# EAGLE design circuito_rele (EAGLE 8.1.1)
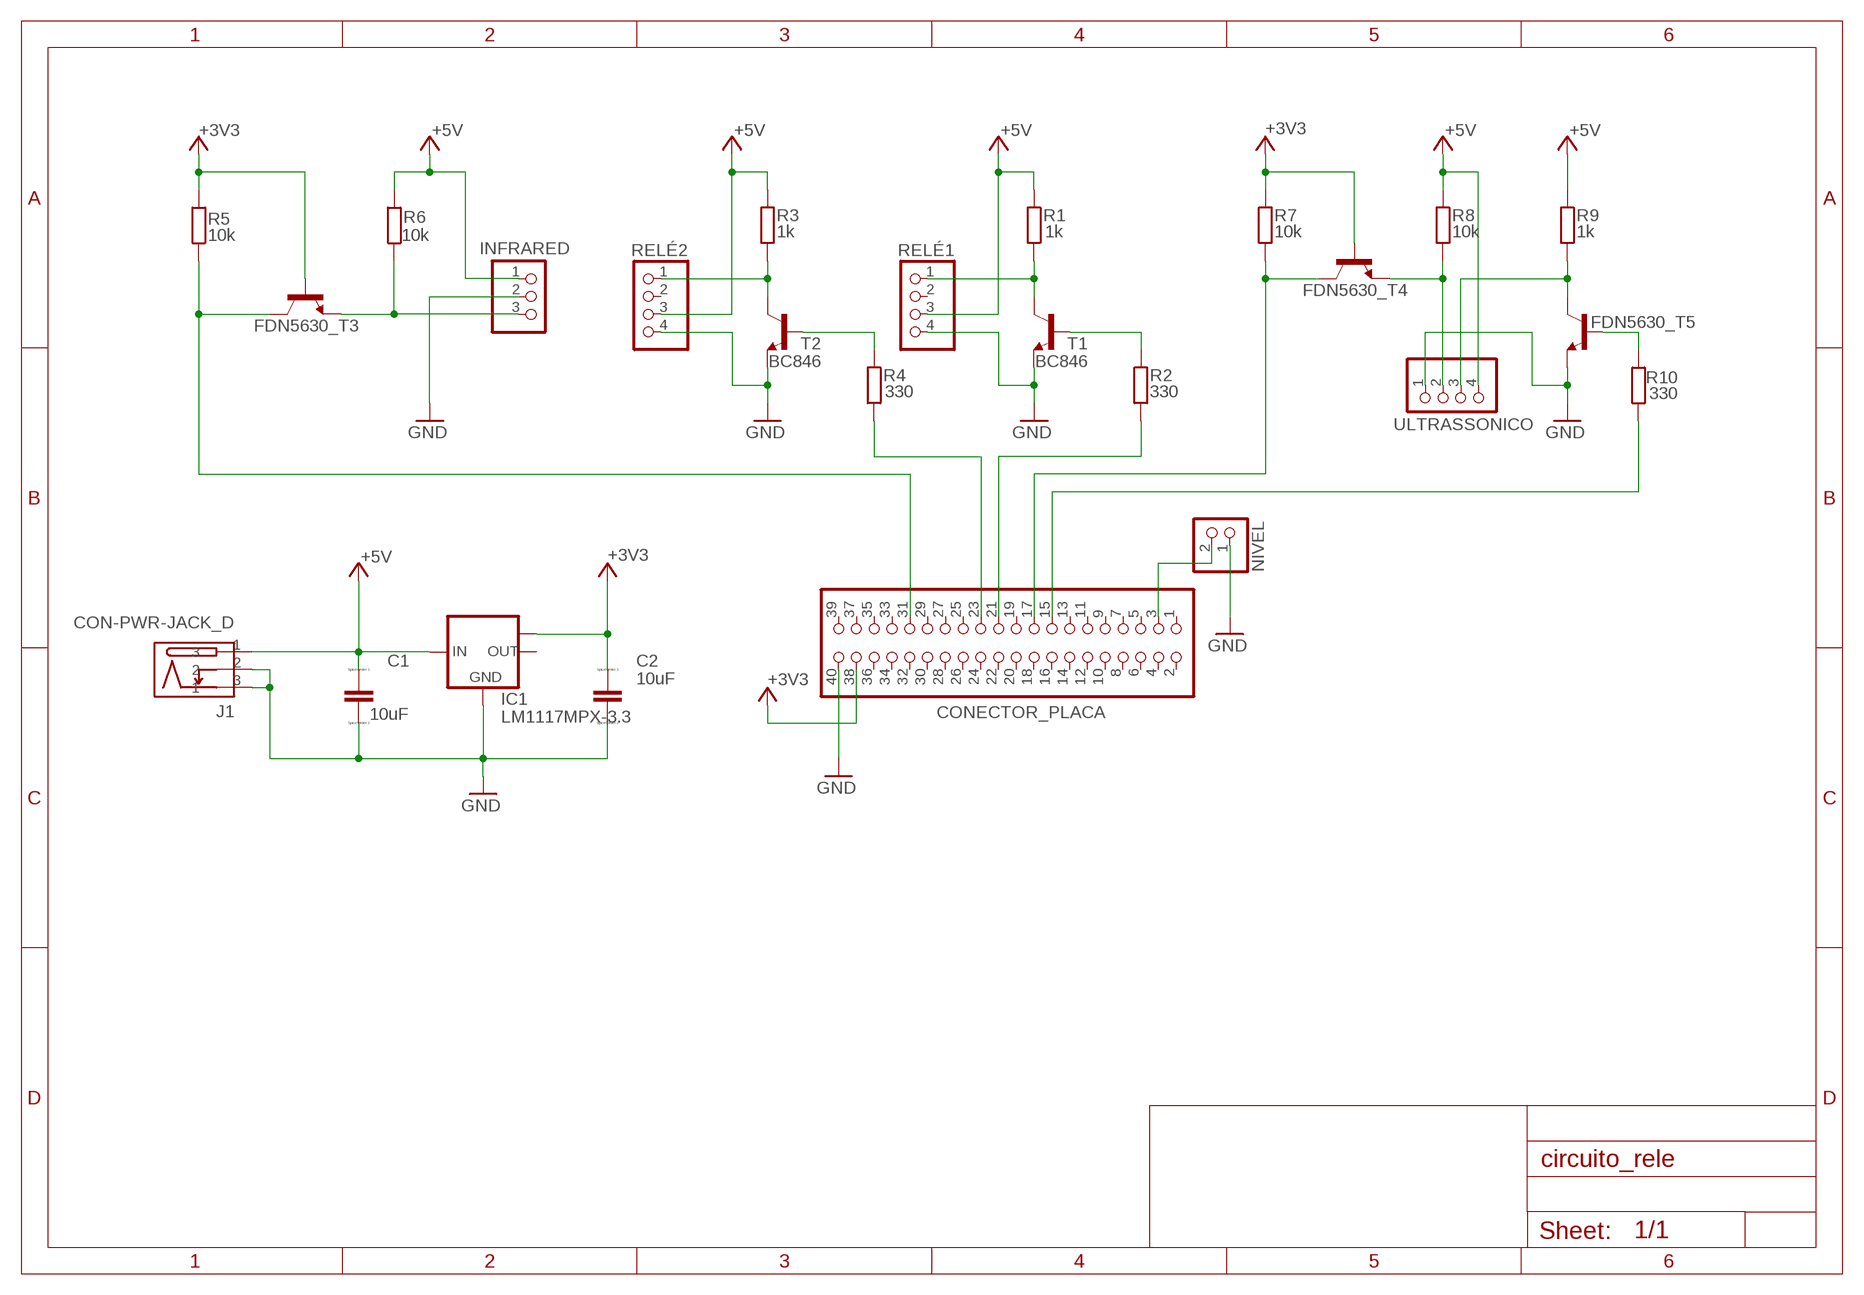
[diagram p0: schematic, sheet 1]

## Parts
C1  10uF  CC4532  [C4532]
C2  10uF  CC4532  [C4532]
CONECTOR_PLACA  PINHD-2X20  [2X20]
FDN5630_T3  BC846  [SOT23]
FDN5630_T4  BC846  [SOT23]
FDN5630_T5  BC846  [SOT23]
IC1  LM1117MPX-3.3  [SOT223]
INFRARED  PINHD-1X3  [1X03]
J1  CON-PWR-JACK_D  [TDC-002-3]
NIVEL  PINHD-1X2  [1X02]
R1  1k  R-EU_0207/10  [0207/10]
R2  330  R-EU_0207/10  [0207/10]
R3  1k  R-EU_0207/10  [0207/10]
R4  330  R-EU_0207/10  [0207/10]
R5  10k  R-EU_0207/10  [0207/10]
R6  10k  R-EU_0207/10  [0207/10]
R7  10k  R-EU_0207/10  [0207/10]
R8  10k  R-EU_0207/10  [0207/10]
R9  1k  R-EU_0207/10  [0207/10]
R10  330  R-EU_0207/10  [0207/10]
RELÉ1  PINHD-1X4  [1X04]
RELÉ2  PINHD-1X4  [1X04]
T1  BC846  [SOT23]
T2  BC846  [SOT23]
ULTRASSONICO  PINHD-1X4  [1X04]

## Nets
+3V3: C2.1 CONECTOR_PLACA.38 FDN5630_T3.1(B) FDN5630_T4.1(B) IC1.TAB(OUT1) R5.2 R7.1
+5V: C1.1 IC1.3(IN) INFRARED.1 J1.1 R1.1 R3.1 R6.2 R8.1 R9.1 RELÉ1.3 RELÉ2.3 ULTRASSONICO.4
GND: C1.2 C2.2 CONECTOR_PLACA.40 FDN5630_T5.2(E) IC1.1(GND) INFRARED.2 J1.2 J1.3 NIVEL.1 RELÉ1.4 RELÉ2.4 T1.2(E) T2.2(E) ULTRASSONICO.1
N$1: R1.2 RELÉ1.1 T1.3(C)
N$2: R4.1 T2.1(B)
N$3: CONECTOR_PLACA.23 R4.2
N$4: R3.2 RELÉ2.1 T2.3(C)
N$5: R2.1 T1.1(B)
N$6: CONECTOR_PLACA.21 R2.2
N$7: FDN5630_T3.2(E) INFRARED.3 R6.1
N$8: CONECTOR_PLACA.17 FDN5630_T4.3(C) R7.2
N$9: CONECTOR_PLACA.31 FDN5630_T3.3(C) R5.1
N$10: FDN5630_T5.3(C) R9.2 ULTRASSONICO.3
N$11: FDN5630_T4.2(E) R8.2 ULTRASSONICO.2
N$12: FDN5630_T5.1(B) R10.2
N$13: CONECTOR_PLACA.15 R10.1
N$14: CONECTOR_PLACA.3 NIVEL.2
Unconnected: CONECTOR_PLACA.1 CONECTOR_PLACA.2 CONECTOR_PLACA.4 CONECTOR_PLACA.5 CONECTOR_PLACA.6 CONECTOR_PLACA.7 CONECTOR_PLACA.8 CONECTOR_PLACA.9 CONECTOR_PLACA.10 CONECTOR_PLACA.11 CONECTOR_PLACA.12 CONECTOR_PLACA.13 CONECTOR_PLACA.14 CONECTOR_PLACA.16 CONECTOR_PLACA.18 CONECTOR_PLACA.19 CONECTOR_PLACA.20 CONECTOR_PLACA.22 CONECTOR_PLACA.24 CONECTOR_PLACA.25 CONECTOR_PLACA.26 CONECTOR_PLACA.27 CONECTOR_PLACA.28 CONECTOR_PLACA.29 CONECTOR_PLACA.30 CONECTOR_PLACA.32 CONECTOR_PLACA.33 CONECTOR_PLACA.34 CONECTOR_PLACA.35 CONECTOR_PLACA.36 CONECTOR_PLACA.37 CONECTOR_PLACA.39 IC1.2(OUT) RELÉ1.2 RELÉ2.2

## Library data of the parts
C1 C2 = eagle-ltspice:C: CAPACITOR, European symbol; SPICEMODEL: NONE; SPICEPREFIX: C
CONECTOR_PLACA = pinhead:PINHD-2X20: PIN HEADER
FDN5630_T3-FDN5630_T5 T1 T2 = transistor:BC846: NPN TRANSISTOR
IC1 = lm1117:LM1117MPX-*
INFRARED = pinhead:PINHD-1X3: PIN HEADER
J1 = m-pad-2.1:CON-PWR-JACK: Various Power Jack with diameter of 2mm, 2.1mm and 2.5mm
NIVEL = pinhead:PINHD-1X2: PIN HEADER
R1-R10 = rcl:R-EU_: RESISTOR, European symbol
RELÉ1 RELÉ2 ULTRASSONICO = pinhead:PINHD-1X4: PIN HEADER

## Board
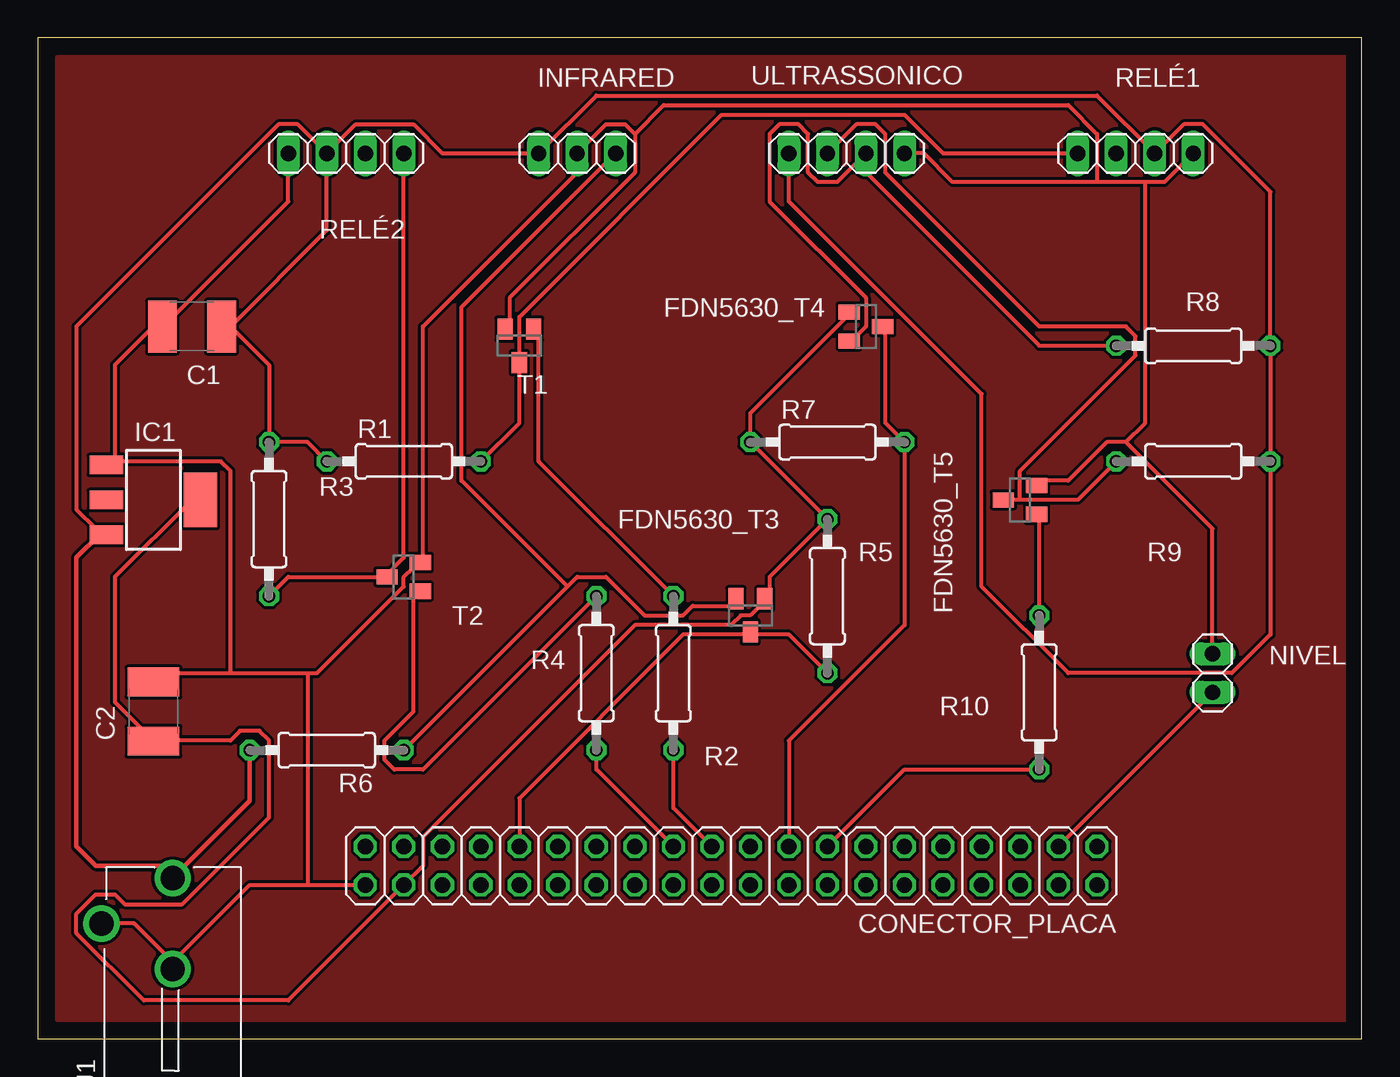
[diagram p1: board, top side]

Size 87.3 x 66.03 mm. Coordinates in mm from the lower left corner, seen from the top.
Outline: 0,0 87.3,0 87.3,66.03 0,66.03 0,0
Copper layers (1*16): Top 0.035mm / dielectric 1.5mm / Bottom 0.035mm
Design rules "default": minimum track width 10mil, minimum drill 24mil, track to track 8mil, track to pad 8mil, pad to pad 8mil, via to via 8mil, smd to smd 8mil, copper to edge 40mil, drill to drill 8mil, minimum pad ring 10mil, minimum via ring 8mil, stop-mask expansion 4mil, vias tented up to drill 0mil, thermal gap 10mil

### Footprints (pad centres in the part's own frame; a part is rotated, then mirrored left to right if it is on the bottom)
C4532 = smd 1.9 x 3.4: 1 -1.95,0; 2 1.95,0
2X20 = drill 1.016 octagon: 1 -24.13,-1.27; 2 -24.13,1.27; 3 -21.59,-1.27; 4 -21.59,1.27; 5 -19.05,-1.27; 6 -19.05,1.27; 7 -16.51,-1.27; 8 -16.51,1.27; 9 -13.97,-1.27; 10 -13.97,1.27; 11 -11.43,-1.27; 12 -11.43,1.27; 13 -8.89,-1.27; 14 -8.89,1.27; 15 -6.35,-1.27; 16 -6.35,1.27; 17 -3.81,-1.27; 18 -3.81,1.27; 19 -1.27,-1.27; 20 -1.27,1.27; 21 1.27,-1.27; 22 1.27,1.27; 23 3.81,-1.27; 24 3.81,1.27; 25 6.35,-1.27; 26 6.35,1.27; 27 8.89,-1.27; 28 8.89,1.27; 29 11.43,-1.27; 30 11.43,1.27; 31 13.97,-1.27; 32 13.97,1.27; 33 16.51,-1.27; 34 16.51,1.27; 35 19.05,-1.27; 36 19.05,1.27; 37 21.59,-1.27; 38 21.59,1.27; 39 24.13,-1.27; 40 24.13,1.27
SOT23 = smd 1 x 1.4: 1 -0.95,-1.1; 2 0.95,-1.1; 3 0,1.1
SOT223 = smd 1.219 x 2.235: 1 -2.311,-3.099; 2 0,-3.099; 3 2.311,-3.099 | smd 3.6 x 2.2: TAB 0,3.099
1X03 = drill 1.016 long: 1 -2.54,0; 2 0,0; 3 2.54,0
TDC-002-3 = drill 1.6: 1 3,0; 2 -3,0; 3 0,4.7
1X02 = drill 1.016 long: 1 -1.27,0; 2 1.27,0
0207/10 = drill 0.813 octagon: 1 -5.08,0; 2 5.08,0
1X04 = drill 1.016 long: 1 -3.81,0; 2 -1.27,0; 3 1.27,0; 4 3.81,0

### Placement (x,y rotation side)
C1  10.16,46.99 180 top
C2  7.62,21.59 90 top
CONECTOR_PLACA  45.72,11.43 180 top
FDN5630_T3  46.99,27.94 180 top
FDN5630_T4  54.61,46.99 270 top
FDN5630_T5  64.77,35.56 90 top
IC1  7.62,35.56 270 top
INFRARED  35.56,58.42 0 top
J1  8.89,7.62 90 top
NIVEL  77.47,24.13 270 top
R1  24.13,38.1 0 top
R2  41.91,24.13 270 top
R3  15.24,34.29 270 top
R4  36.83,24.13 270 top
R5  52.07,29.21 90 top
R6  19.05,19.05 180 top
R7  52.07,39.37 0 top
R8  76.2,45.72 180 top
R9  76.2,38.1 180 top
R10  66.04,22.86 90 top
RELÉ1  72.39,58.42 0 top
RELÉ2  20.32,58.42 180 top
T1  31.75,45.72 180 top
T2  24.13,30.48 90 top
ULTRASSONICO  53.34,58.42 180 top

### Tracks (layer width: path | path; a pad name or v marks a point on that pad's centre or on a via)
+3V3
  Top 0.254: 7.62,19.68 5.08,22.23 5.08,30.48 10.16,35.56 IC1.TAB | FDN5630_T4.1 53.34,47.62 46.99,41.27 R7.1 R5.2 48.26,30.48 48.26,29.21 FDN5630_T3.1 47.62,28.57 46.99,27.94 46.35,27.94 45.72,27.3 39.37,27.3 25.4,13.34 25.4,11.43 CONECTOR_PLACA.38 16.51,2.54 6.99,2.54 2.54,6.99 2.54,8.26 3.81,9.53 5.08,9.53 5.71,8.89 9.53,8.89 15.24,14.61 15.24,19.68 14.61,20.32 13.34,20.32 12.7,19.68 7.62,19.68 | 7.62,19.68 C2.1
+5V
  Top 0.254: ULTRASSONICO.4 49.53,55.24 62.23,42.55 62.23,29.84 67.94,24.13 78.74,24.13 81.28,26.67 R9.1 R8.1 81.28,55.88 76.83,60.33 75.56,60.33 RELÉ1.3 69.85,62.23 36.83,62.23 INFRARED.1 26.67,58.42 24.77,60.33 20.95,60.33 RELÉ2.3 | R1.1 17.78,39.37 R3.1 15.24,44.45 12.7,46.99 | RELÉ2.3 19.05,53.34 12.7,46.99 | 12.7,46.99 C1.1 | RELÉ2.3 17.14,60.33 15.88,60.33 2.54,46.99 2.54,34.92 3.81,33.66 4.45,33.66 IC1.3
  Top 0.305: IC1.3 4.04,33.25 2.54,31.75 2.54,12.7 3.81,11.43 8.08,11.43 J1.1 13.97,15.7 R6.2
GND
  Top 0.254: ULTRASSONICO.1 58.42,58.42 60.33,56.52 69.85,56.52 | 73.03,56.52 74.3,56.52 RELÉ1.4 | 73.03,56.52 69.85,56.52 | 71.75,39.37 70.48,39.37 67.94,36.83 66.04,36.83 FDN5630_T5.2 | 71.75,39.37 77.47,33.66 NIVEL.1 | 73.03,56.52 73.03,40.64 71.75,39.37 | 5.08,38.1 5.08,44.45 7.62,46.99 C1.2 8.26,46.99 16.51,55.24 RELÉ2.4 | 17.78,10.16 13.97,10.16 8.89,5.08 | 17.78,10.16 CONECTOR_PLACA.40 | J1.3 6.35,7.62 8.89,5.08 | 8.89,5.08 J1.2 | 39.37,59.69 39.37,57.15 31.11,48.9 31.11,46.99 T1.2 | 39.37,59.69 38.73,60.33 37.47,60.33 INFRARED.2 35.56,57.15 25.4,46.99 25.4,31.75 T2.2 24.77,31.11 24.13,30.48 24.13,29.84 18.41,24.13 17.78,24.13 | 12.7,24.13 7.62,24.13 C2.2 | 12.7,24.13 17.78,24.13 | 17.78,24.13 17.78,10.16 | 5.08,38.1 12.06,38.1 12.7,37.47 12.7,24.13 | 5.08,38.1 IC1.1 | 69.85,56.52 69.85,59.69 67.94,61.59 41.27,61.59 39.37,59.69
N$1
  Top 0.254: R1.2 31.75,40.64 T1.3 31.75,47.62 45.09,60.96 57.15,60.96 59.69,58.42 RELÉ1.1
N$2
  Top 0.254: R4.1 25.4,17.78 23.5,17.78 22.86,18.41 22.86,19.68 24.77,21.59 24.77,29.21 T2.1
N$3
  Top 0.254: R4.2 36.83,17.78 CONECTOR_PLACA.23
N$4
  Top 0.254: 22.86,30.48 16.51,30.48 R3.2 | RELÉ2.1 24.13,31.75 22.86,30.48 | 22.86,30.48 T2.3
N$5
  Top 0.254: R2.1 33.02,38.1 33.02,46.35 T1.1
N$6
  Top 0.254: R2.2 41.91,15.24 CONECTOR_PLACA.21
N$7
  Top 0.254: R6.1 34.92,29.84 | 34.92,29.84 35.56,30.48 37.47,30.48 40.01,27.94 42.55,27.94 43.18,28.57 45.72,28.57 FDN5630_T3.2 | INFRARED.3 27.94,48.26 27.94,36.83 34.92,29.84
N$8
  Top 0.254: FDN5630_T4.3 55.88,46.99 55.88,40.64 R7.2 57.15,27.3 49.53,19.68 CONECTOR_PLACA.17
N$9
  Top 0.254: 46.81,26.77 FDN5630_T3.3 46.99,26.67 | 46.99,26.67 49.53,26.67 R5.1 | CONECTOR_PLACA.31 31.75,15.88 42.55,26.67 46.99,26.67
N$10
  Top 0.254: 71.27,38.2 R9.2 68.58,35.56 64.77,35.56 | 64.77,35.56 FDN5630_T5.3 | ULTRASSONICO.3 53.98,60.33 55.24,60.33 55.88,59.69 55.88,57.15 66.04,46.99 71.75,46.99 72.39,46.35 72.39,45.09 64.77,37.47 64.77,35.56
N$11
  Top 0.254: 53.98,57.78 52.7,56.52 51.44,56.52 50.8,57.15 50.8,59.69 50.16,60.33 48.9,60.33 48.26,59.69 48.26,55.24 54.61,48.9 54.61,46.99 53.98,46.35 FDN5630_T4.2 | R8.2 66.04,45.72 53.98,57.78 | 53.98,57.78 ULTRASSONICO.2
N$12
  Top 0.254: R10.2 66.04,34.29 FDN5630_T5.1
N$13
  Top 0.254: R10.1 57.15,17.78 CONECTOR_PLACA.15
N$14
  Top 0.254: NIVEL.2 CONECTOR_PLACA.3
N$15
  pour Top: 1.27,64.77 86.36,64.77 86.36,1.27 1.27,1.27